# EAGLE design programmer-esp-atmega (EAGLE 9.6.2)
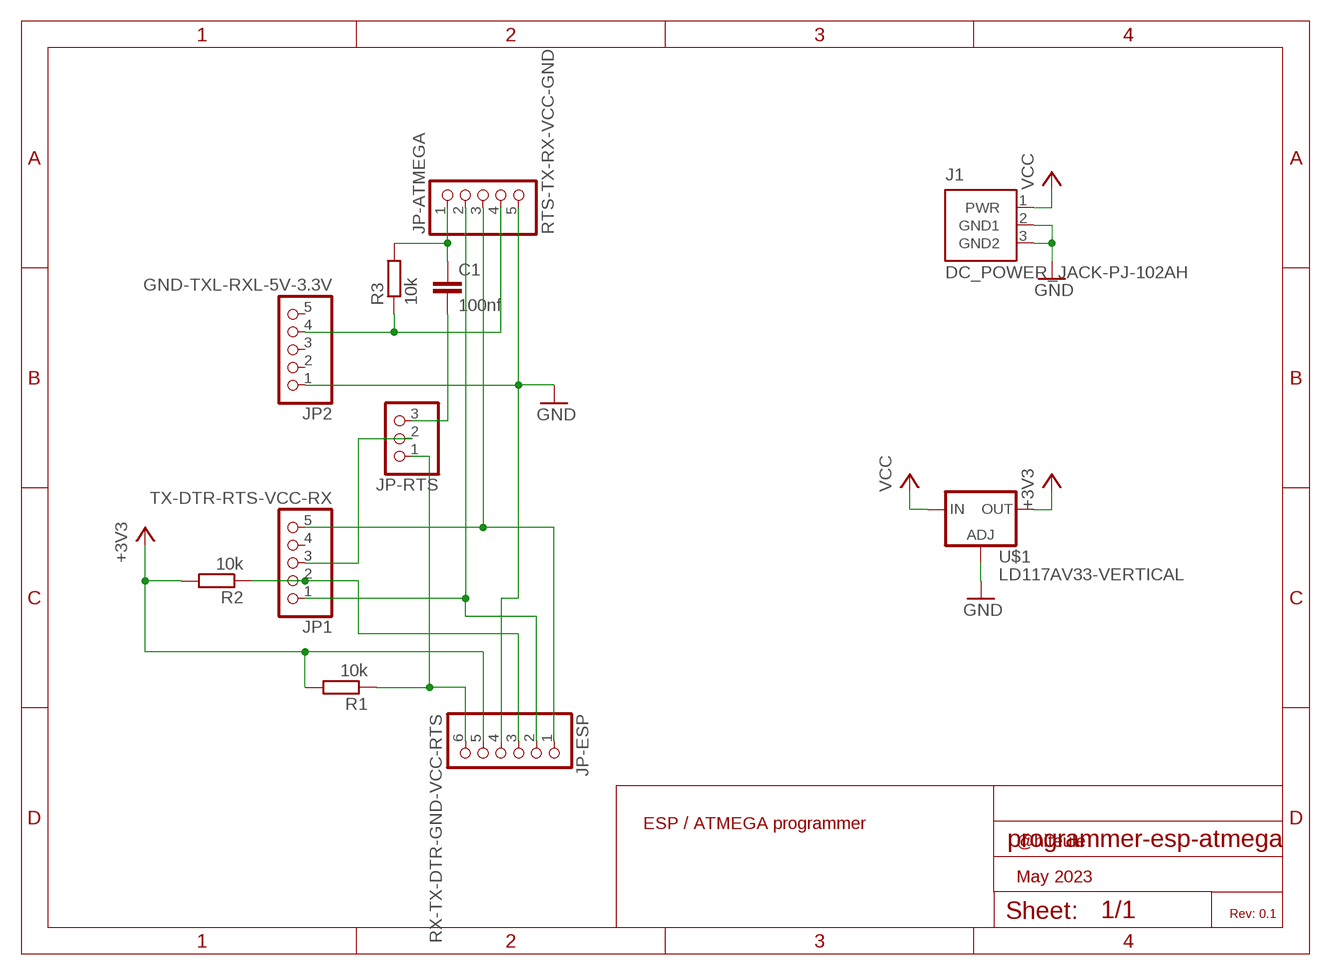
[diagram p0: schematic, sheet 1]

## Parts
C1  100nf  C-EU025-024X044  [C025-024X044]
J1  DC_POWER_JACK-PJ-102AH  [PJ-102AH]
JP1  TX-DTR-RTS-VCC-RX  PINHD-1X5  [1X05]
JP2  GND-TXL-RXL-5V-3.3V  PINHD-1X5  [1X05]
JP-ATMEGA  RTS-TX-RX-VCC-GND  PINHD-1X5  [1X05]
JP-ESP  RX-TX-DTR-GND-VCC-RTS  PINHD-1X6  [1X06]
JP-RTS  PINHD-1X3  [1X03]
R1  10k  R-EU_0207/10  [0207/10]
R2  10k  R-EU_0207/10  [0207/10]
R3  10k  R-EU_0207/10  [0207/10]
U$1  LD117AV33-VERTICAL  [TO220S-VERTICAL]

## Nets
+3V3: JP-ESP.5 R1.2 R2.2 U$1.2(OUT)
GND: J1.2(GND1) J1.3(GND2) JP2.1 JP-ATMEGA.5 JP-ESP.4 U$1.1(ADJ)
N$2: JP2.4 JP-ATMEGA.4 R3.1
N$3: JP1.5 JP-ATMEGA.3 JP-ESP.1
N$4: JP1.1 JP-ATMEGA.2 JP-ESP.2
N$5: C1.2 JP-RTS.3
N$6: C1.1 JP-ATMEGA.1 R3.2
N$8: JP1.3 JP-RTS.2
N$9: JP-ESP.6 JP-RTS.1 R1.1
N$11: JP1.2 JP-ESP.3 R2.1
VCC: J1.1(PWR) U$1.3(IN)
Unconnected: JP1.4 JP2.2 JP2.3 JP2.5

## Notes on the sheet
- ESP / ATMEGA programmer
- @hiteule
- May 2023
- Rev: 0.1

## Library data of the parts
C1 = rcl:C-EU: CAPACITOR, European symbol; SPICEPREFIX: C
J1 = CONNECTORS:DC_POWER_JACK: DC Power Jack
JP1 JP2 JP-ATMEGA = pinhead:PINHD-1X5: PIN HEADER
JP-ESP = pinhead:PINHD-1X6: PIN HEADER
JP-RTS = pinhead:PINHD-1X3: PIN HEADER
R1-R3 = rcl:R-EU_: RESISTOR, European symbol; SPICEPREFIX: R
U$1 = regulator:LD117AV33-VERTICAL

## Board
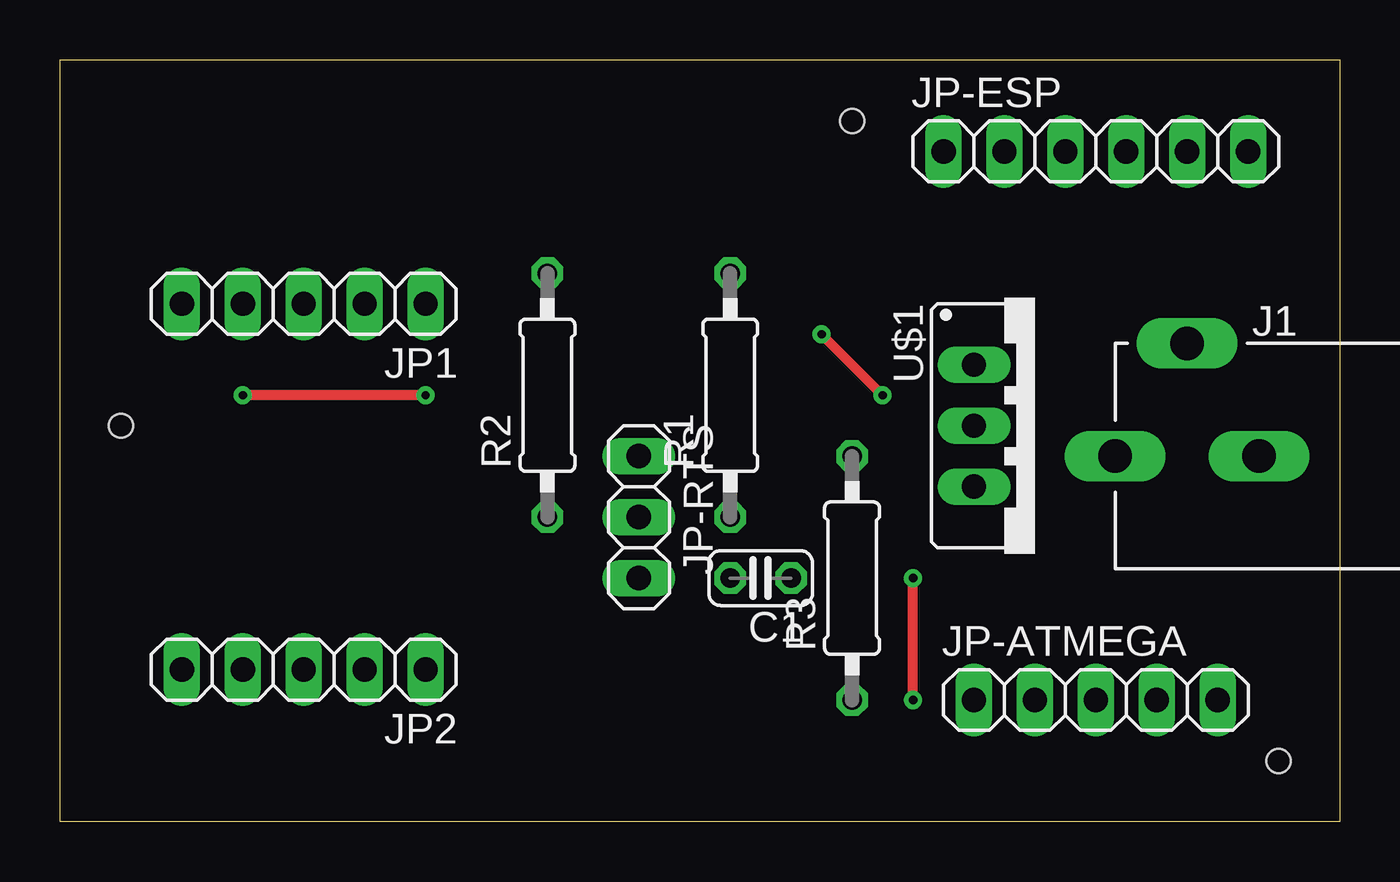
[diagram p1: board, top side]
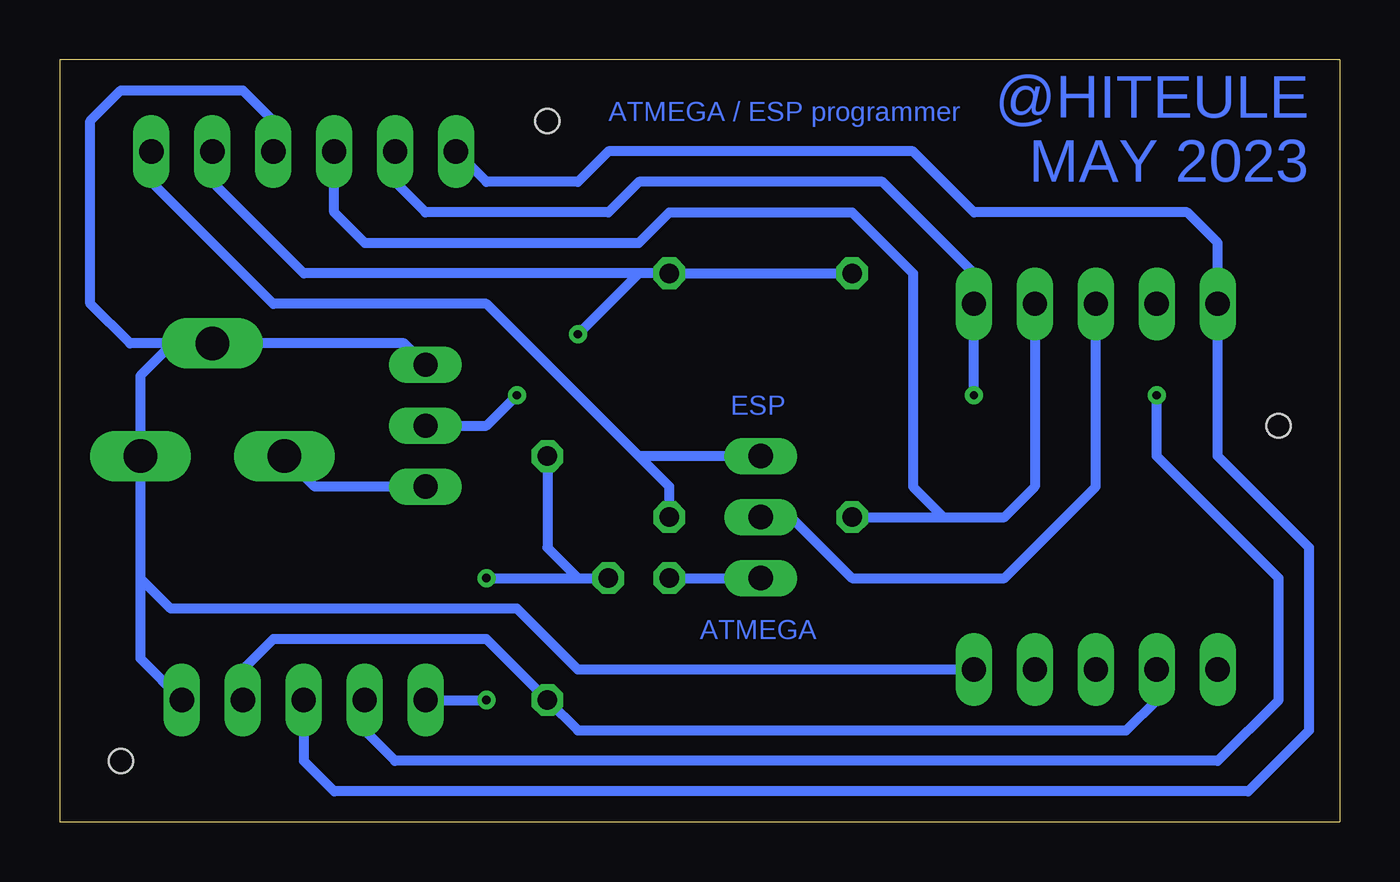
[diagram p2: board, bottom side, seen from below]

Size 53.34 x 31.75 mm. Coordinates in mm from the lower left corner, seen from the top.
Outline: 0,31.75 53.34,31.75 53.34,0 0,0 0,31.75
Copper layers (1*16): Top 0.035mm / dielectric 1.5mm / Bottom 0.035mm
Design rules "default": minimum track width 6mil, minimum drill 0.35mm, track to track 6mil, track to pad 6mil, pad to pad 6mil, via to via 6mil, smd to smd 6mil, copper to edge 40mil, drill to drill 6mil, minimum pad ring 10mil, minimum via ring 8mil, stop-mask expansion 4mil, vias tented up to drill 0mil, thermal gap 10mil
Holes 1 mm at 2.54,16.51 50.8,2.54 33.02,29.21

### Footprints (pad centres in the part's own frame; a part is rotated, then mirrored left to right if it is on the bottom)
C025-024X044 = drill 0.813 octagon: 1 -1.27,0; 2 1.27,0
PJ-102AH = drill 1.4 long: 1 0,-3; 2 0,3; 3 -4.7,0
1X05 = drill 1.016 long: 1 -5.08,0; 2 -2.54,0; 3 0,0; 4 2.54,0; 5 5.08,0
1X06 = drill 1.016 long: 1 -6.35,0; 2 -3.81,0; 3 -1.27,0; 4 1.27,0; 5 3.81,0; 6 6.35,0
1X03 = drill 1.016 long: 1 -2.54,0; 2 0,0; 3 2.54,0
0207/10 = drill 0.813 octagon: 1 -5.08,0; 2 5.08,0
TO220S-VERTICAL = drill 1.016 long: 1 -2.54,-2.54; 2 0,-2.54; 3 2.54,-2.54

### Placement (x,y rotation side)
C1  29.21,10.16 180 top
J1  46.99,15.24 270 top
JP1  10.16,21.59 180 top
JP2  10.16,6.35 180 top
JP-ATMEGA  43.18,5.08 0 top
JP-ESP  43.18,27.94 0 top
JP-RTS  24.13,12.7 270 top
R1  27.94,17.78 90 top
R2  20.32,17.78 90 top
R3  33.02,10.16 90 top
U$1  40.64,16.51 270 top

### Tracks (layer width: path | path; a pad name or v marks a point on that pad's centre or on a via)
+3V3  (via drill 0.35)
  Top 0.406: v34.29,17.78 v31.75,20.32
  Bottom 0.406: R2.2 R1.2 29.21,22.86 | U$1.2 35.56,16.51 v34.29,17.78 | v31.75,20.32 29.21,22.86 | 29.21,22.86 43.18,22.86 46.99,26.67 JP-ESP.5
GND
  Bottom 0.406: JP2.1 31.75,6.35 34.29,8.89 48.72,8.89 49.99,10.16 | J1.3 48.64,19.94 49.99,18.59 J1.2 49.99,10.16 | U$1.1 38.99,19.94 J1.3 | J1.3 50.42,19.94 52.07,21.59 52.07,29.21 50.8,30.48 45.72,30.48 44.45,29.21 JP-ESP.4 | 49.99,10.16 49.99,6.81 JP-ATMEGA.5
N$2
  Bottom 0.406: JP-ATMEGA.4 45.72,6.35 44.45,7.62 35.56,7.62 R3.1 31.75,3.81 8.89,3.81 7.62,5.08 JP2.4
N$3
  Bottom 0.406: JP-ATMEGA.3 43.18,2.54 41.91,1.27 3.81,1.27 1.27,3.81 1.27,11.43 5.08,15.24 JP1.5 5.08,24.13 6.35,25.4 15.24,25.4 17.78,27.94 30.48,27.94 31.75,26.67 35.56,26.67 JP-ESP.1
N$4  (via drill 0.35)
  Top 0.406: v15.24,17.78 v7.62,17.78
  Bottom 0.406: JP-ATMEGA.2 40.64,3.81 39.37,2.54 5.08,2.54 2.54,5.08 2.54,10.16 7.62,15.24 v7.62,17.78 | v15.24,17.78 JP1.1 15.24,22.86 19.05,26.67 29.21,26.67 30.48,25.4 38.1,25.4 39.37,26.67 JP-ESP.2
N$5
  Bottom 0.406: C1.2 JP-RTS.3
N$6  (via drill 0.35)
  Top 0.406: v35.56,5.08 v35.56,10.16
  Bottom 0.406: JP-ATMEGA.1 v35.56,5.08 | v35.56,10.16 31.75,10.16 | 31.75,10.16 C1.1 | R3.2 33.02,11.43 31.75,10.16
N$8
  Bottom 0.406: JP1.3 10.16,13.97 13.97,10.16 20.32,10.16 22.86,12.7 JP-RTS.2
N$9
  Bottom 0.406: JP-ESP.6 49.53,26.67 44.45,21.59 35.56,21.59 29.21,15.24 | JP-RTS.1 29.21,15.24 | R1.1 27.94,13.97 29.21,15.24
N$11
  Bottom 0.406: JP1.2 12.7,13.97 13.97,12.7 16.51,12.7 | JP-ESP.3 41.91,25.4 40.64,24.13 29.21,24.13 27.94,25.4 20.32,25.4 17.78,22.86 17.78,13.97 16.51,12.7 | R2.1 16.51,12.7
VCC
  Bottom 0.406: U$1.3 42.72,13.97 J1.1

### Text on the board
Bottom: ATMEGA / ESP programmer | @HITEULE / MAY 2023 | ESP | ATMEGA